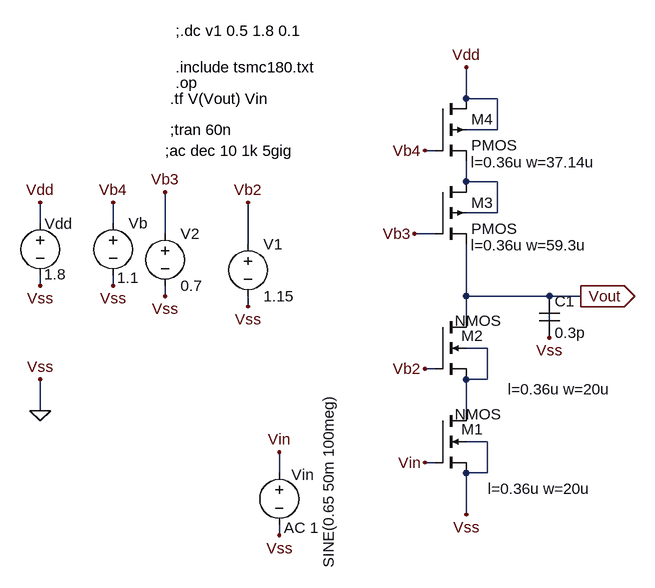
[diagram p0: schematic Cascode_CSA_3 with current source with 1Ghz.asc]
Cascode_CSA_3 with current source with 1Ghz.asc, the LTspice schematic file:
Version 4
SHEET 1 1056 680
WIRE 496 -544 496 -592
WIRE 544 -544 496 -544
WIRE 544 -496 544 -544
WIRE 544 -496 496 -496
WIRE 448 -464 432 -464
WIRE 496 -416 496 -448
WIRE 544 -416 496 -416
WIRE 544 -368 544 -416
WIRE 544 -368 496 -368
WIRE -160 -352 -160 -384
WIRE -48 -352 -48 -384
WIRE 32 -336 32 -400
WIRE 448 -336 416 -336
WIRE 160 -320 160 -384
WIRE -160 -256 -160 -272
WIRE -48 -256 -48 -272
WIRE 32 -240 32 -256
WIRE 496 -240 496 -320
WIRE 624 -240 496 -240
WIRE 672 -240 624 -240
WIRE 160 -224 160 -240
WIRE 496 -208 496 -240
WIRE 624 -176 624 -224
WIRE 528 -160 496 -160
WIRE 448 -128 432 -128
WIRE 528 -112 528 -160
WIRE 528 -112 496 -112
WIRE -160 -64 -160 -112
WIRE 496 -64 496 -112
WIRE 528 -16 496 -16
WIRE 448 16 432 16
WIRE 208 32 208 0
WIRE 528 32 528 -16
WIRE 528 32 496 32
WIRE 496 96 496 32
WIRE 208 128 208 112
FLAG -160 -64 0
FLAG -160 -112 Vss
FLAG 208 0 Vin
FLAG -160 -256 Vss
FLAG 208 128 Vss
FLAG -160 -384 Vdd
FLAG 496 -592 Vdd
FLAG 496 96 Vss
FLAG 672 -240 Vout
IOPIN 672 -240 Out
FLAG 432 16 Vin
FLAG -48 -256 Vss
FLAG -48 -384 Vb4
FLAG 432 -128 Vb2
FLAG 160 -224 Vss
FLAG 160 -384 Vb2
FLAG 432 -464 Vb4
FLAG 416 -336 Vb3
FLAG 32 -240 Vss
FLAG 32 -400 Vb3
FLAG 624 -176 Vss
SYMBOL nmos4 448 -64 R0
WINDOW 0 40 29 Left 2
WINDOW 3 30 6 Left 2
WINDOW 123 240 120 Right 2
SYMATTR InstName M1
SYMATTR Value2 l=0.36u w=20u
SYMBOL voltage -160 -368 R0
WINDOW 123 0 0 Left 0
WINDOW 39 0 0 Left 0
WINDOW 0 7 17 Left 2
WINDOW 3 6 94 Left 2
SYMATTR InstName Vdd
SYMATTR Value 1.8
SYMBOL voltage 208 16 R0
WINDOW 0 19 19 Left 2
WINDOW 3 76 -106 VRight 2
WINDOW 123 7 100 Left 2
WINDOW 39 0 0 Left 0
SYMATTR InstName Vin
SYMATTR Value SINE(0.65 50m 100meg)
SYMATTR Value2 AC 1
SYMBOL cap 608 -240 R0
SYMATTR InstName C1
SYMATTR Value 0.3p
SYMBOL voltage -48 -368 R0
WINDOW 123 0 0 Left 0
WINDOW 39 0 0 Left 0
WINDOW 3 6 100 Left 2
SYMATTR Value 1.1
SYMATTR InstName Vb
SYMBOL nmos4 448 -208 R0
WINDOW 0 40 29 Left 2
WINDOW 3 30 6 Left 2
WINDOW 123 271 111 Right 2
SYMATTR InstName M2
SYMATTR Value2 l=0.36u w=20u
SYMBOL voltage 160 -336 R0
WINDOW 123 0 0 Left 0
WINDOW 39 0 0 Left 0
SYMATTR InstName V1
SYMATTR Value 1.15
SYMBOL pmos4 448 -544 R0
WINDOW 123 55 98 Left 2
SYMATTR Value2 l=0.36u w=37.14u
SYMATTR InstName M4
SYMBOL pmos4 448 -416 R0
WINDOW 123 55 98 Left 2
SYMATTR Value2 l=0.36u w=59.3u
SYMATTR InstName M3
SYMBOL voltage 32 -352 R0
WINDOW 123 0 0 Left 0
WINDOW 39 0 0 Left 0
SYMATTR InstName V2
SYMATTR Value 0.7
TEXT 48 -592 Left 2 !.include tsmc180.txt
TEXT 48 -568 Left 2 !.op
TEXT 40 -544 Left 2 !.tf V(Vout) Vin
TEXT 32 -464 Left 2 !;ac dec 10 1k 5gig
TEXT 40 -496 Left 2 !;tran 60n
TEXT 48 -648 Left 2 !;.dc v1 0.5 1.8 0.1

The netlist it stands for:
* Cascode_CSA_3 with current source with 1Ghz.asc
M1 N002 Vin 0 0 NMOS l=0.36u w=20u
Vdd Vdd 0 1.8
Vin Vin 0 SINE(0.65 50m 100meg) AC 1
C1 Vout 0 0.3p
Vb Vb4 0 1.1
M2 Vout Vb2 N002 N002 NMOS l=0.36u w=20u
V1 Vb2 0 1.15
M4 Vdd Vb4 N001 Vdd PMOS l=0.36u w=37.14u
M3 N001 Vb3 Vout N001 PMOS l=0.36u w=59.3u
V2 Vb3 0 0.7
.model NMOS NMOS
.model PMOS PMOS
.lib standard.mos
.include tsmc180.txt
.op
.tf V(Vout) Vin
;ac dec 10 1k 5gig
;tran 60n
;.dc v1 0.5 1.8 0.1
.backanno
.end